# EAGLE schematic pyacqua (EAGLE 4.16)
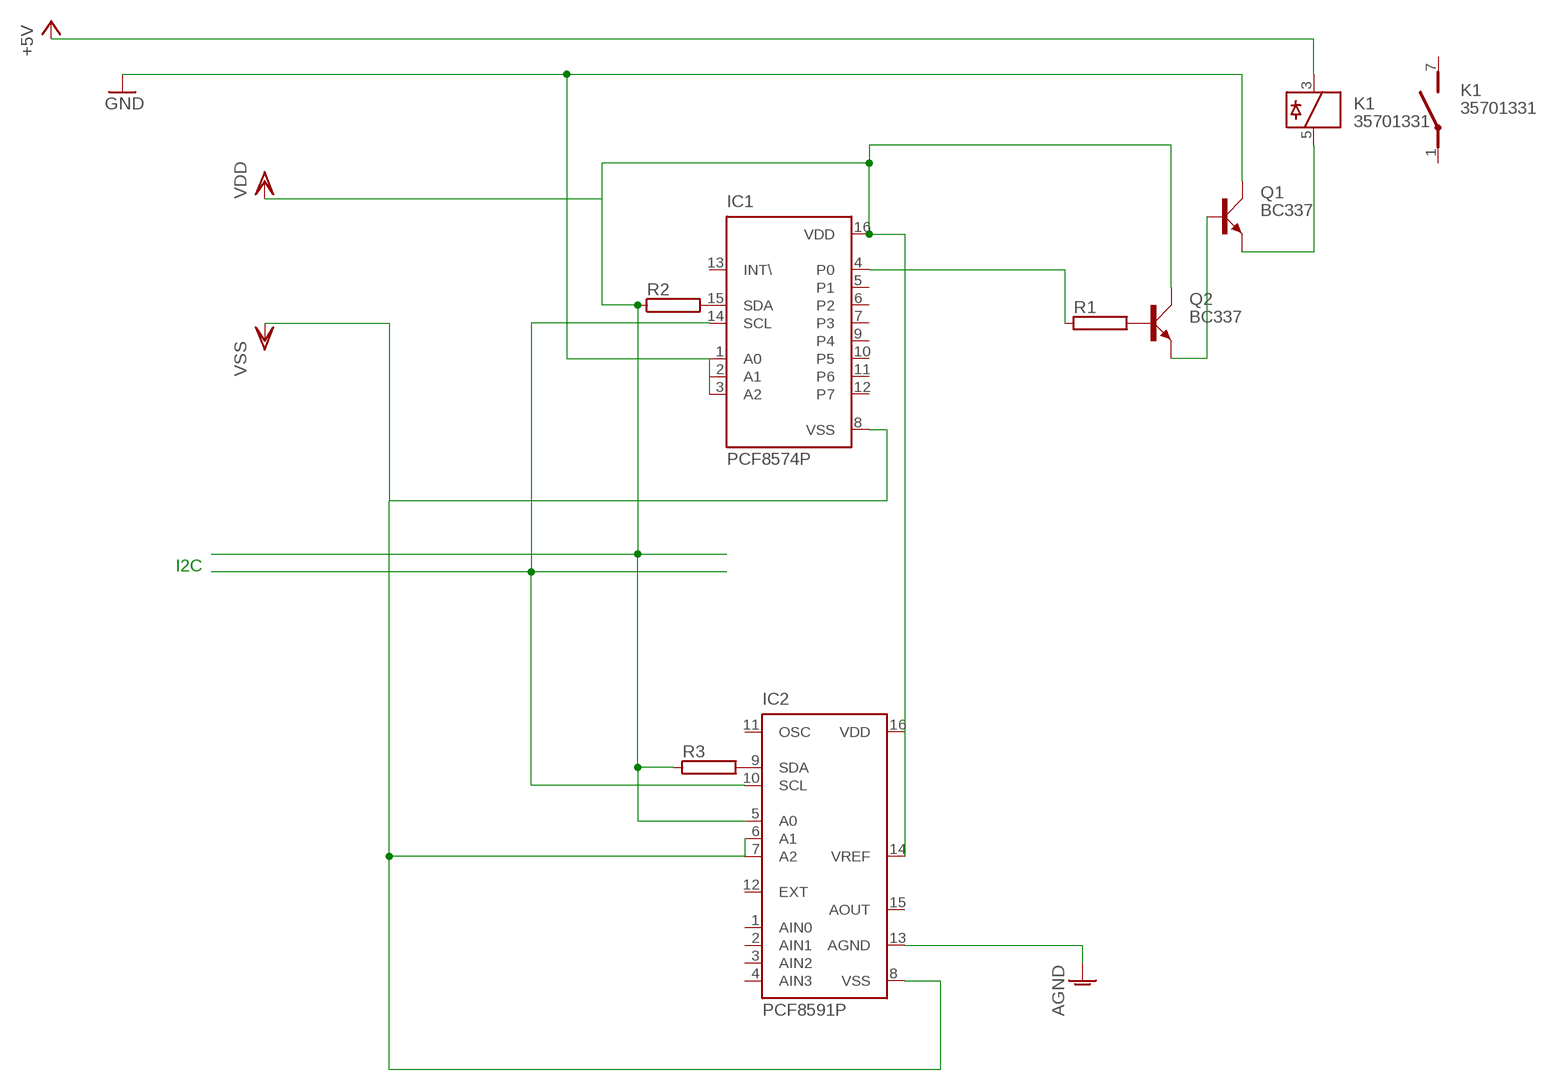
[diagram p0: schematic, sheet 1]

## Parts
IC1  PCF8574P  [DIL16]
IC2  PCF8591P  [DIL16]
K1  35701331  [REED]
Q1  BC337  [SOT54A]
Q2  BC337  [SOT54A]
R1  RKH206-8  [KH206-8]
R2  RKH206-8  [KH206-8]
R3  RKH206-8  [KH206-8]

## Nets
+5V: K1.3
AGND: IC2.13(AGND)
GND: IC1.1(A0) IC1.2(A1) IC1.3(A2) Q1.C
N$1: Q2.B R1.2
N$2: IC1.15(SDA) R2.2
N$3: IC1.4(P0) R1.1
N$7: IC2.9(SDA) R3.2
N$8: Q1.B Q2.E
N$11: K1.5 Q1.E
N$14: IC1.14(SCL) IC2.10(SCL)
VDD: IC1.16(VDD) IC2.5(A0) IC2.14(VREF) IC2.16(VDD) Q2.C R2.1 R3.1
VSS: IC1.8(VSS) IC2.6(A1) IC2.7(A2) IC2.8(VSS)
Unconnected: IC1.5(P1) IC1.6(P2) IC1.7(P3) IC1.9(P4) IC1.10(P5) IC1.11(P6) IC1.12(P7) IC1.13(INT\) IC2.1(AIN0) IC2.2(AIN1) IC2.3(AIN2) IC2.4(AIN3) IC2.11(OSC) IC2.12(EXT) IC2.15(AOUT) K1.1(2:P) K1.7(2:S)

## Notes on the sheet
- I2C

## Library data of the parts
IC1 = micro-philips:PCF8574: I2C-Bus I/O DEVICE
IC2 = micro-philips:PCF8591: I2C-Bus D/A CONVERTER
K1 = relay:35701331: RELAY reed, 1 x norm. open with polarity
Q1 Q2 = transistor-small-signal:BC337: NPN TRANSISTOR
R1-R3 = resistor-power:R: Power Resitor